# Altium schematic sheet dsau-dds-clock.SchDoc: dSAU Motherboard - DDS Clock Gen.
size Letter; Engineer: Christopher J. Woodall; Organization: Boston University EDF/ECE; DocumentNumber: 5; Revision: A; SheetNumber: 5; SheetTotal: 10; EMAIL: cwoodall@bu.edu; TeamName: Team 19; ProjectName: dSAU
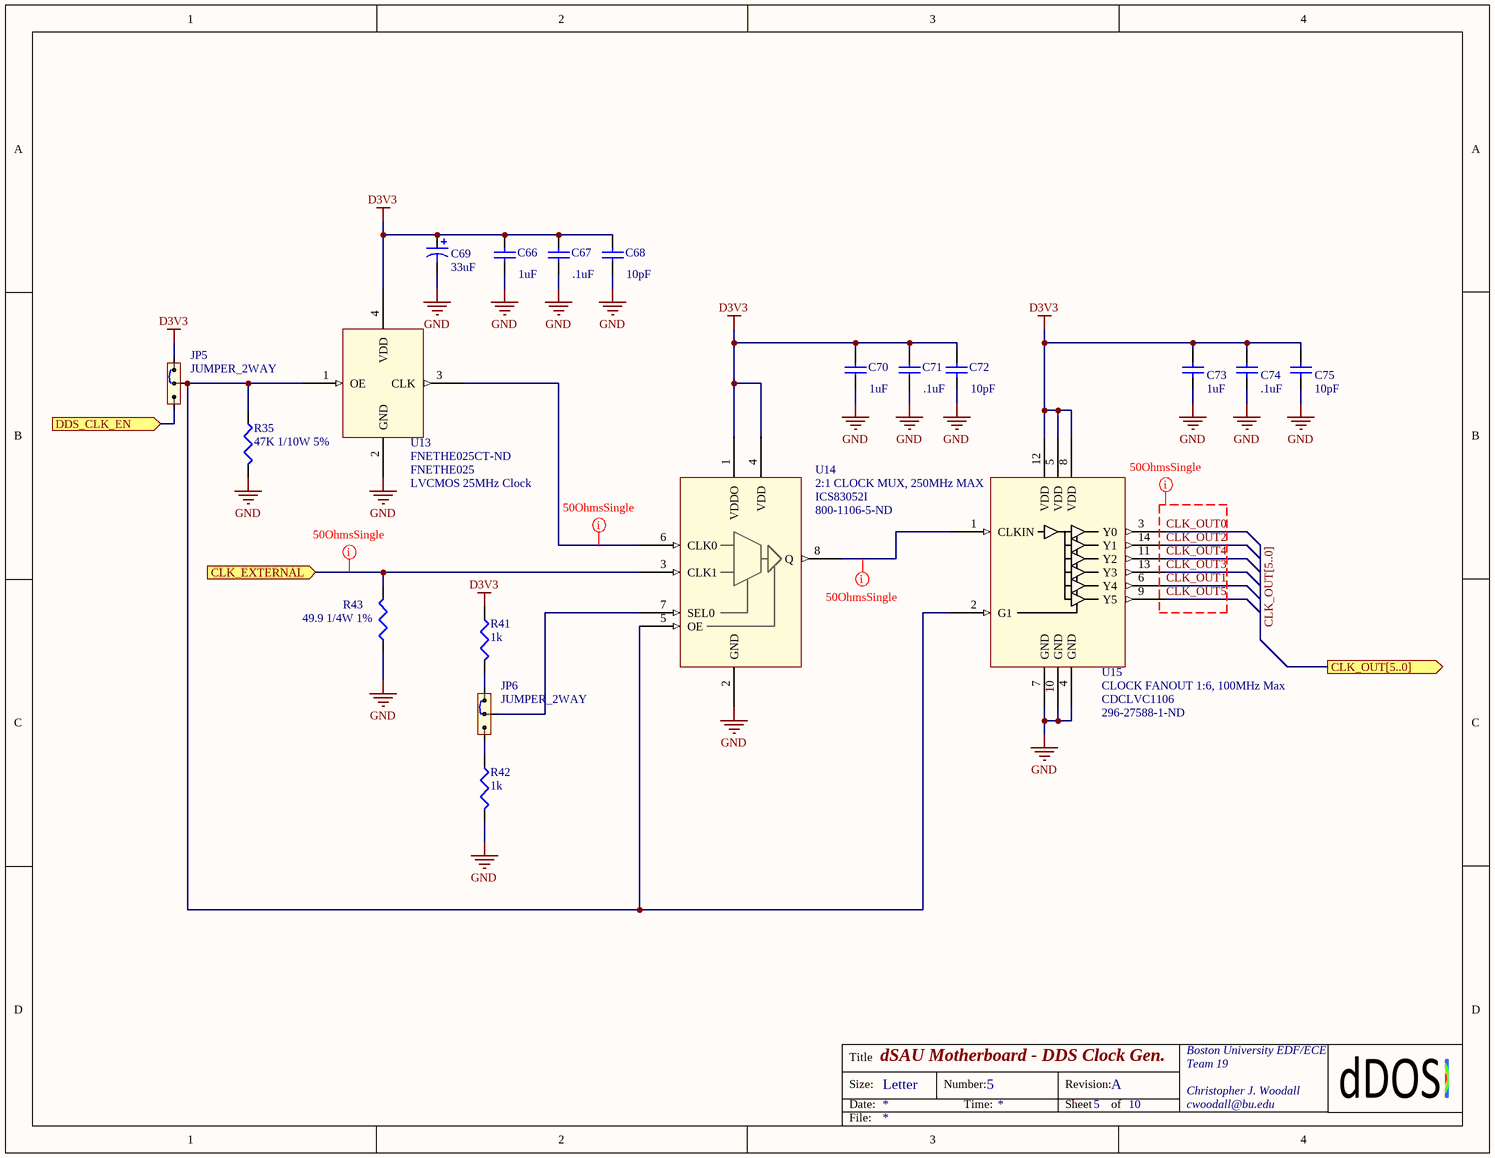
[diagram p0: dsau-dds-clock.SchDoc]

## Parts
C66  value 1uF  [CAPC2012L]  (hidden comment: CER 1UF 16V 10% X7R)
C67  value .1uF  [CAPC1608L]  (hidden comment: CER 0.1UF 50V Y5V)
C68  value 10pF  [CAPC1608L]  (hidden comment: CER 10PF 50V 5% NP0)
C69  value 33uF  [CAPC2012L]  (hidden comment: TANT 33UF 6.3V 10%)
C70  value 1uF  [CAPC2012L]  (hidden comment: CER 1UF 16V 10% X7R)
C71  value .1uF  [CAPC1608L]  (hidden comment: CER 0.1UF 50V Y5V)
C72  value 10pF  [CAPC1608L]  (hidden comment: CER 10PF 50V 5% NP0)
C73  value 1uF  [CAPC2012L]  (hidden comment: CER 1UF 16V 10% X7R)
C74  value .1uF  [CAPC1608L]  (hidden comment: CER 0.1UF 50V Y5V)
C75  value 10pF  [CAPC1608L]  (hidden comment: CER 10PF 50V 5% NP0)
JP5  JUMPER_2WAY  [HDR1X3]
JP6  JUMPER_2WAY  [HDR1X3]
R35  47K 1/10W 5%  [RESC1608L]
R41  value 1k  [RESC1608L]  (hidden comment: 100 1/10W 1%)
R42  value 1k  [RESC1608L]  (hidden comment: 100 1/10W 1%)
R43  49.9 1/4W 1%  [RESC3216L]
U13  LVCMOS 25MHz Clock  Supplier Part Number 1: FNETHE025CT-ND  [FNETHE025_4SMD]
U14  2:1 CLOCK MUX, 250MHz MAX  Supplier Part Number 1: 800-1106-5-ND  [SOP65P780-8M]
U15  CLOCK FANOUT 1:6, 100MHz Max  Supplier Part Number 1: 296-27588-1-ND  [TSOP65P640-14AM]

## Ports
CLK_EXTERNAL (in), CLK_OUT[5..0] (out), DDS_CLK_EN (in)

## Nets
D3V3: C66.1 C67.1 C68.1 C69.1 C70.1 C71.1 C72.1 C73.1 C74.1 C75.1 JP5.1 R41.1 U13.4(VDD) U14.1(VDDO) U14.4(VDD) U15.5(VDD) U15.8(VDD) U15.12(VDD)
GND: C66.2 C67.2 C68.2 C69.2 C70.2 C71.2 C72.2 C73.2 C74.2 C75.2 R35.2 R42.2 R43.1 U13.2(GND) U14.2(GND) U15.4(GND) U15.7(GND) U15.10(GND)
CLK_EXTERNAL: R43.2 U14.3(CLK1) ; port CLK_EXTERNAL
CLK_OUT0: U15.3(Y0)
CLK_OUT1: U15.6(Y4)
CLK_OUT2: U15.14(Y1)
CLK_OUT3: U15.13(Y3)
CLK_OUT4: U15.11(Y2)
CLK_OUT5: U15.9(Y5)
DDS_CLK_EN: JP5.3 ; port DDS_CLK_EN
NetJP5_2: JP5.2 R35.1 U13.1(OE) U14.5(OE) U15.2(G1)
NetJP6_1: JP6.1 R41.2
NetJP6_2: JP6.2 U14.7(SEL0)
NetJP6_3: JP6.3 R42.1
NetU13_3: U13.3(CLK) U14.6(CLK0)
NetU14_8: U14.8(Q) U15.1(CLKIN)

## Buses and harness runs
bus CLK_OUT[5..0] = port CLK_OUT[5..0]

## Layout directives
net class 50OhmsSingle: CLK_EXTERNAL, CLK_OUT0, CLK_OUT1, CLK_OUT2, CLK_OUT3, CLK_OUT4, CLK_OUT5, NetU13_3, NetU14_8

## Notes on the sheet
- Title
- Size:
- Date:
- Letter
- Number:
- Time:
- Revision:
- Sheet
- of
- File:

## Library data of the parts
C66 C70 C73 = Cap: Capacitor; Manufacturer: Yageo; Manufacturer Part Number: CC0805KKX7R7BB105; Published: 8-Jun-2000; LatestRevisionDate: 17-Jul-2002; LatestRevisionNote: Re-released for DXP Platform.; PackageReference: RAD-0.3; Publisher: Altium Limited; Supplier 1: Digi-Key; Supplier Part Number 1: 311-1365-1-ND
C67 C71 C74 = Cap: Capacitor; Manufacturer: Yageo; Manufacturer Part Number: CC0603ZRY5V9BB104; Published: 8-Jun-2000; LatestRevisionDate: 17-Jul-2002; LatestRevisionNote: Re-released for DXP Platform.; PackageReference: RAD-0.3; Publisher: Altium Limited; Supplier 1: Digi-Key; Supplier Part Number 1: 311-1343-1-ND
C68 C72 C75 = Cap: Capacitor; Manufacturer: Samsung Electro-Mechanics America, Inc; Manufacturer Part Number: CL10C100JB8NCNC; Published: 8-Jun-2000; LatestRevisionDate: 17-Jul-2002; LatestRevisionNote: Re-released for DXP Platform.; PackageReference: RAD-0.3; Publisher: Altium Limited; Supplier 1: Digi-Key; Supplier Part Number 1: 1276-2154-1-ND
C69 = Cap Pol3: Polarized Capacitor (Surface Mount); Manufacturer: AVX Corporation; Manufacturer Part Number: TPSA336K006R0600; Published: 8-Jun-2000; LatestRevisionDate: 29-May-2009; LatestRevisionNote: IPC-7351 Footprint Added.; PackageReference: C1206; Publisher: Altium Limited; PackageDescription: Chip Capacitor; Supplier 1: Digi-Key; Supplier Part Number 1: 478-1755-1-ND
R35 = Res3: Resistor; Manufacturer: Yageo; Manufacturer Part Number: 311-47kGRCT-ND; Published: 8-Jun-2000; LatestRevisionDate: 29-May-2009; LatestRevisionNote: IPC-7351 Footprint Added.; PackageReference: J1-0603; Publisher: Altium Limited; PackageDescription: Chip Resistor; Value: 47K; Supplier 1: Digi-Key; Supplier Part Number 1: 311-47KGRTR-ND
R41 R42 = Res3: Resistor; Manufacturer: Yageo; Manufacturer Part Number: RC0603JR-071KL; Published: 8-Jun-2000; LatestRevisionDate: 29-May-2009; LatestRevisionNote: IPC-7351 Footprint Added.; PackageReference: J1-0603; Publisher: Altium Limited; PackageDescription: Chip Resistor; Supplier 1: Digi-Key; Supplier Part Number 1: 311-1.0KGRCT-ND
R43 = Res3: Resistor; Manufacturer: Panasonic Electronic Components; Manufacturer Part Number: ERJ-8ENF49R9V; Value: 49.9; Published: 8-Jun-2000; LatestRevisionDate: 29-May-2009; LatestRevisionNote: IPC-7351 Footprint Added.; PackageReference: J1-0603; Publisher: Altium Limited; PackageDescription: Chip Resistor; Supplier 1: Digi-Key; Supplier Part Number 1: P49.9FCT-ND
U13 = FNETHE025: Manufacturer: Pericom; Supplier 1: Digi-Key; Manufacturer Part Number: FNETHE025
U14 = ICS83052I: Manufacturer: IDT; Supplier 1: Digi-Key; Manufacturer Part Number: ICS83052I
U15 = CDCLVC1106: Clock Fanout 1:6, 100MHz low-skew; Manufacturer: Texas Instruments; Supplier 1: Digi-Key; Manufacturer Part Number: CDCLVC1106